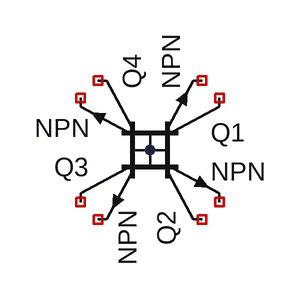
[diagram p0: schematic Draft10.asc]
Draft10.asc, the LTspice schematic file:
Version 4
SHEET 1 880 680
SYMBOL npn 240 80 R0
SYMATTR InstName Q1
SYMBOL npn 288 128 R90
SYMATTR InstName Q2
SYMBOL npn 240 176 R180
SYMATTR InstName Q3
SYMBOL npn 192 128 R270
SYMATTR InstName Q4

The netlist it stands for:
* Draft10.asc
Q1 NC_01 P001 NC_02 0 NPN
Q2 NC_03 P001 NC_04 0 NPN
Q3 NC_05 P001 NC_06 0 NPN
Q4 NC_07 P001 NC_08 0 NPN
.model NPN NPN
.model PNP PNP
.lib standard.bjt
.backanno
.end